# EAGLE schematic CEM-8bit-PCF8574 (EAGLE 6.1)
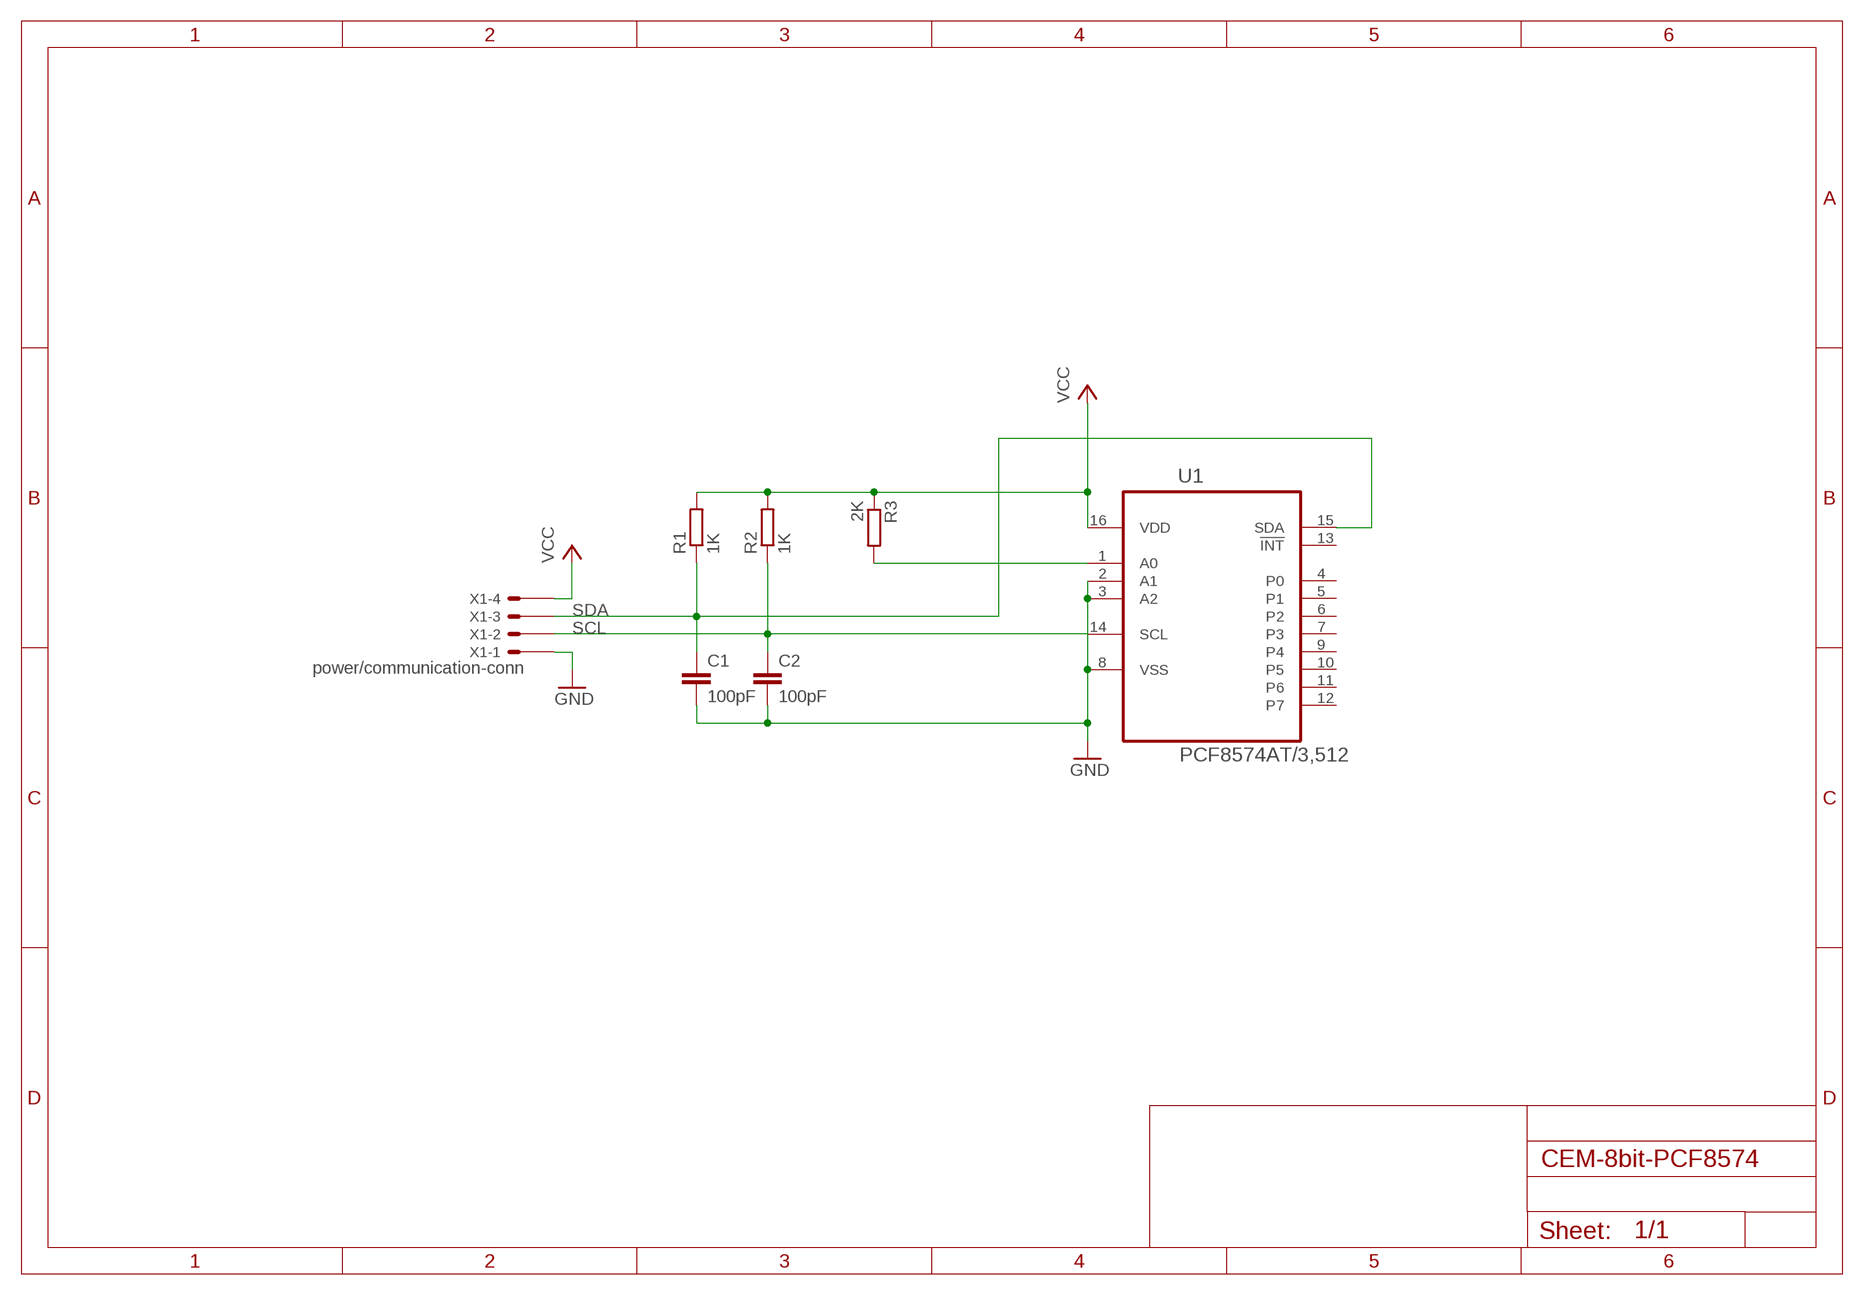
[diagram p0: schematic, sheet 1]

## Parts
C1  100pF  C-EUC0805K  [C0805K]
C2  100pF  C-EUC0805K  [C0805K]
R1  1K  R-EU_M1406  [M1406]
R2  1K  R-EU_M1406  [M1406]
R3  2K  R-EU_M1406  [M1406]
U1  PCF8574AT/3,512  [SOIC127P1032X265-16N]
X1  power/communication-conn  43160-1204  [43160-XX04]

## Nets
GND: C1.2 C2.2 U1.2(A1) U1.3(A2) U1.8(VSS) X1.1@1(-1:S)
N$1: R3.2 U1.1(A0)
SCL: C2.1 R2.1 U1.14(SCL) X1.2@1(-2:S)
SDA: C1.1 R1.1 U1.15(SDA) X1.3@1(-3:S)
VCC: R1.2 R2.2 R3.1 U1.16(VDD) X1.4@1(-4:S)
Unconnected: U1.4(P0) U1.5(P1) U1.6(P2) U1.7(P3) U1.9(P4) U1.10(P5) U1.11(P6) U1.12(P7) U1.13(!INT) X1.1@2(-1:S) X1.2@2(-2:S) X1.3@2(-3:S) X1.4@2(-4:S)

## Library data of the parts
C1 C2 = rcl:C-EU: CAPACITOR, European symbol
R1-R3 = rcl:R-EU_: RESISTOR, European symbol
U1 = PCF8574:PCF8574AT/3,512: IC, I/O EXPANDER, 8BIT, 16SOIC; MPN: PCF8574AT/3,512; OC_FARNELL: 2101302; OC_NEWARK: 70R6866; PACKAGE: SOIC-16; SUPPLIER: NXP
X1 = con-molex:43160-*04: SDA-43160 Connector Source: http://www.molex.com/pdm_docs/sd/431601306_sd.pdf; OC_FARNELL: unknown; OC_NEWARK: unknown